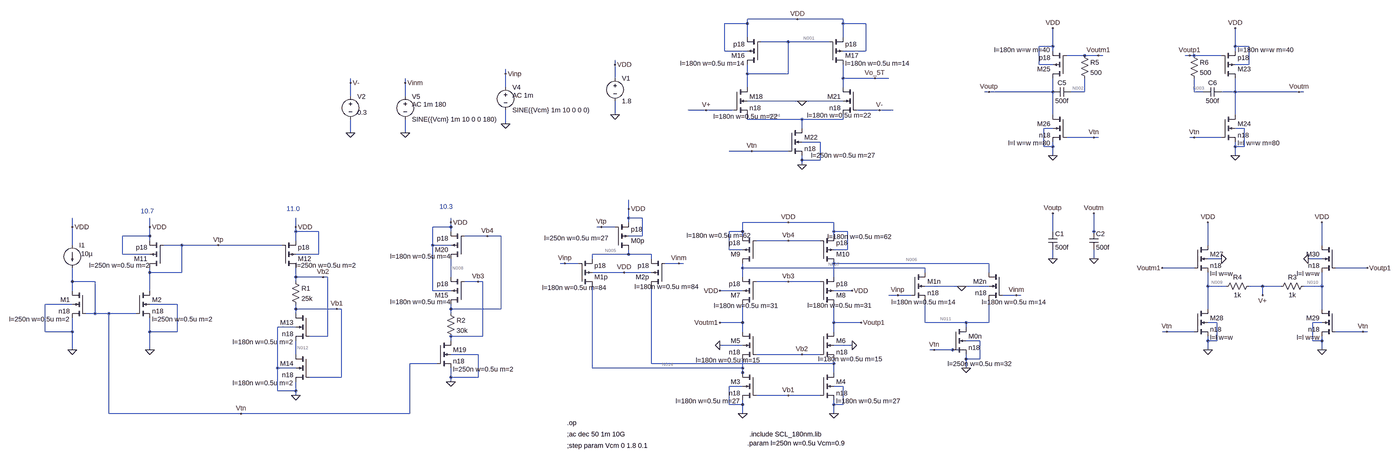
[diagram p0: schematic final_complete_design.asc, whole sheet]
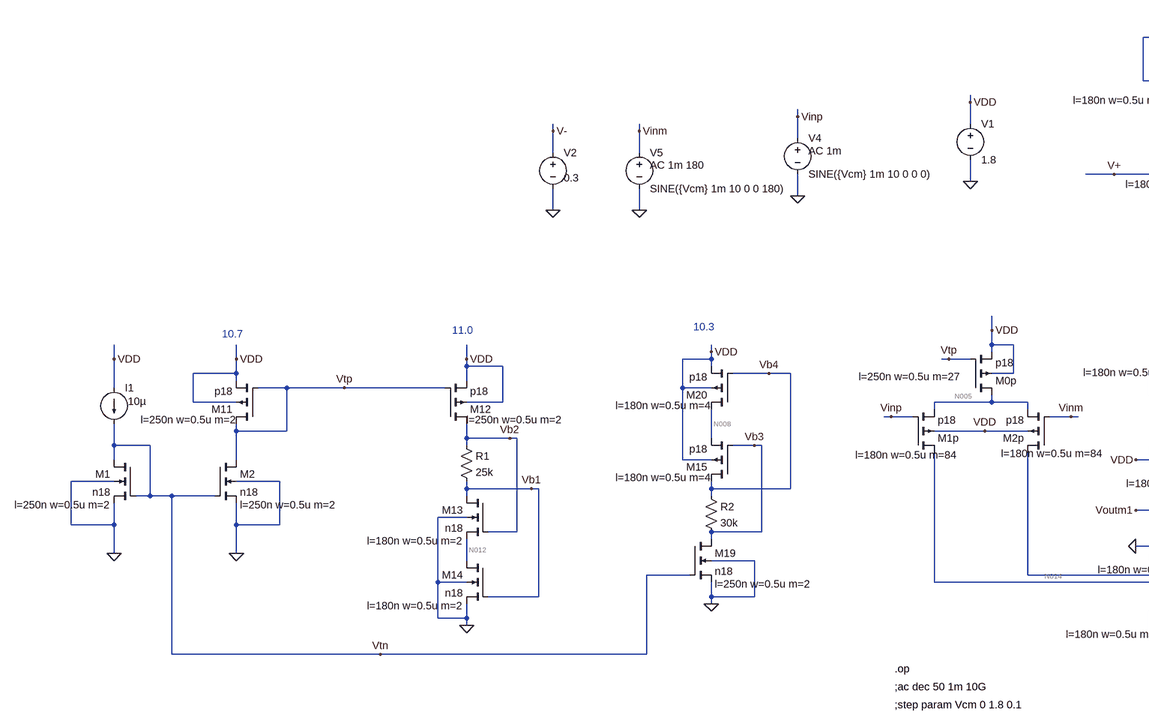
[diagram p1: schematic final_complete_design.asc, part, row 1 of 1, column 1 of 2]
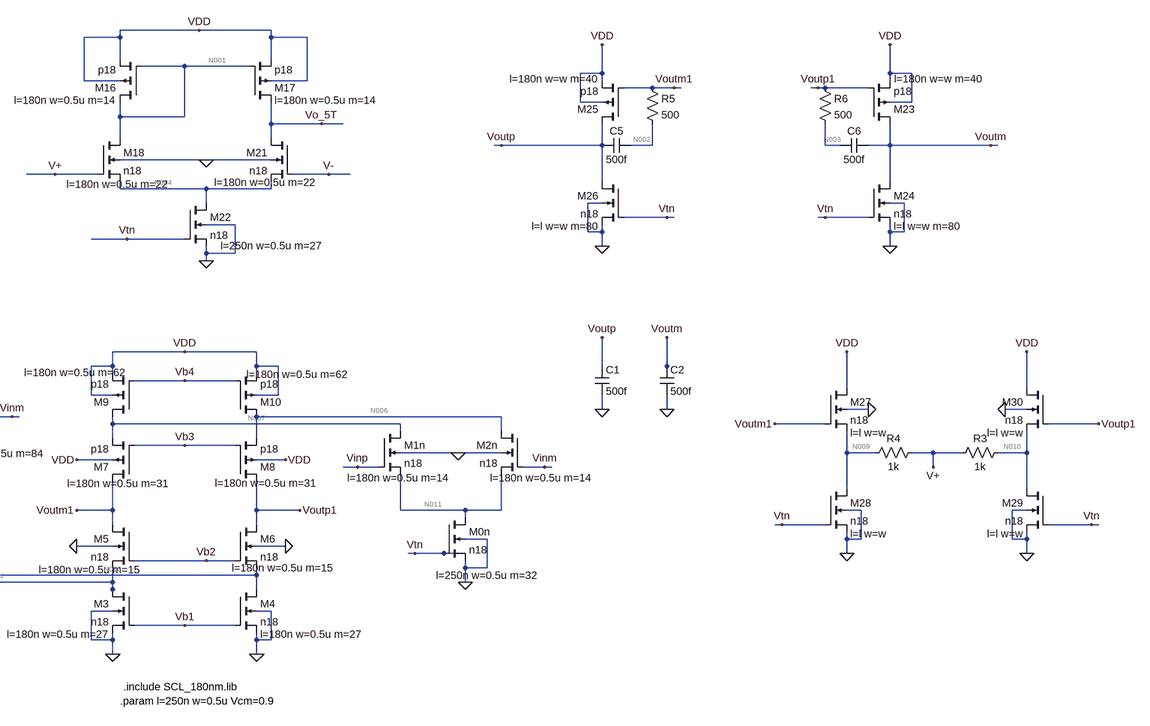
[diagram p2: schematic final_complete_design.asc, part, row 1 of 1, column 2 of 2]
final_complete_design.asc, the LTspice schematic file:
Version 4
SHEET 1 2868 680
WIRE 544 -1072 368 -1072
WIRE 704 -1072 544 -1072
WIRE 368 -1056 368 -1072
WIRE 368 -1056 288 -1056
WIRE 704 -1056 704 -1072
WIRE 784 -1056 704 -1056
WIRE 368 -1008 368 -1056
WIRE 704 -1008 704 -1056
WIRE 512 -992 416 -992
WIRE 656 -992 512 -992
WIRE 1440 -976 1440 -1040
WIRE 1440 -976 1392 -976
WIRE 2080 -976 2080 -1040
WIRE 2128 -976 2080 -976
WIRE 288 -960 288 -1056
WIRE 368 -960 288 -960
WIRE 784 -960 784 -1056
WIRE 784 -960 704 -960
WIRE 1440 -960 1440 -976
WIRE 2080 -960 2080 -976
WIRE 1552 -944 1488 -944
WIRE 1600 -944 1552 -944
WIRE 1616 -944 1600 -944
WIRE 1920 -944 1904 -944
WIRE 1936 -944 1920 -944
WIRE 2032 -944 1936 -944
WIRE -96 -912 -96 -928
WIRE 1392 -912 1392 -976
WIRE 1440 -912 1392 -912
WIRE 2128 -912 2128 -976
WIRE 2128 -912 2080 -912
WIRE -480 -880 -480 -896
WIRE 368 -880 368 -912
WIRE 512 -880 512 -992
WIRE 512 -880 368 -880
WIRE -96 -864 -96 -912
WIRE 704 -864 704 -912
WIRE 816 -864 704 -864
WIRE 864 -864 816 -864
WIRE -1024 -848 -1024 -864
WIRE -832 -848 -832 -864
WIRE -480 -832 -480 -880
WIRE 368 -832 368 -880
WIRE 704 -832 704 -864
WIRE 1216 -816 1200 -816
WIRE 1440 -816 1440 -864
WIRE 1440 -816 1216 -816
WIRE 1552 -816 1552 -864
WIRE 1552 -816 1504 -816
WIRE 1936 -816 1936 -864
WIRE 1968 -816 1936 -816
WIRE 2080 -816 2080 -864
WIRE 2080 -816 2032 -816
WIRE 2304 -816 2080 -816
WIRE 2320 -816 2304 -816
WIRE -1024 -800 -1024 -848
WIRE -832 -800 -832 -848
WIRE 560 -784 368 -784
WIRE 704 -784 560 -784
WIRE 224 -752 160 -752
WIRE 320 -752 224 -752
WIRE 832 -752 752 -752
WIRE 880 -752 832 -752
WIRE -96 -736 -96 -784
WIRE 1440 -736 1440 -816
WIRE 2080 -736 2080 -816
WIRE 368 -720 368 -736
WIRE 560 -720 368 -720
WIRE 704 -720 704 -736
WIRE 704 -720 560 -720
WIRE -480 -704 -480 -752
WIRE 560 -688 560 -720
WIRE 1440 -688 1408 -688
WIRE 2112 -688 2080 -688
WIRE -1024 -672 -1024 -720
WIRE -832 -672 -832 -720
WIRE 1584 -656 1488 -656
WIRE 1600 -656 1584 -656
WIRE 1936 -656 1920 -656
WIRE 2032 -656 1936 -656
WIRE 624 -640 560 -640
WIRE 1408 -624 1408 -688
WIRE 1440 -624 1440 -640
WIRE 1440 -624 1408 -624
WIRE 2080 -624 2080 -640
WIRE 2112 -624 2112 -688
WIRE 2112 -624 2080 -624
WIRE 384 -608 304 -608
WIRE 512 -608 384 -608
WIRE 1440 -592 1440 -624
WIRE 2080 -592 2080 -624
WIRE 560 -576 560 -592
WIRE 624 -576 624 -640
WIRE 624 -576 560 -576
WIRE 560 -560 560 -576
WIRE -48 -352 -48 -384
WIRE -48 -320 -48 -352
WIRE 0 -320 -48 -320
WIRE -672 -304 -672 -320
WIRE -48 -304 -48 -320
WIRE 512 -304 352 -304
WIRE 672 -304 512 -304
WIRE -2000 -288 -2000 -320
WIRE -1728 -288 -1728 -320
WIRE -1216 -288 -1216 -320
WIRE -672 -288 -672 -304
WIRE -672 -288 -736 -288
WIRE -144 -288 -160 -288
WIRE -96 -288 -144 -288
WIRE -1216 -272 -1216 -288
WIRE -1136 -272 -1216 -272
WIRE -672 -272 -672 -288
WIRE 352 -272 352 -304
WIRE 352 -272 304 -272
WIRE 672 -272 672 -304
WIRE 720 -272 672 -272
WIRE 1440 -272 1440 -336
WIRE 1584 -272 1584 -336
WIRE -1728 -256 -1728 -288
WIRE -1728 -256 -1824 -256
WIRE -544 -256 -624 -256
WIRE -496 -256 -544 -256
WIRE 0 -256 0 -320
WIRE 0 -256 -48 -256
WIRE 352 -256 352 -272
WIRE 672 -256 672 -272
WIRE 1584 -256 1584 -272
WIRE -1728 -240 -1728 -256
WIRE -1216 -240 -1216 -272
WIRE 512 -240 400 -240
WIRE 624 -240 512 -240
WIRE -2000 -224 -2000 -288
WIRE -1616 -224 -1680 -224
WIRE -1488 -224 -1616 -224
WIRE -1264 -224 -1488 -224
WIRE -736 -224 -736 -288
WIRE -672 -224 -736 -224
WIRE 1984 -224 1984 -304
WIRE 2384 -224 2384 -304
WIRE 304 -208 304 -272
WIRE 352 -208 304 -208
WIRE 720 -208 720 -272
WIRE 720 -208 672 -208
WIRE -1824 -192 -1824 -256
WIRE -1728 -192 -1824 -192
WIRE -1136 -192 -1136 -272
WIRE -1136 -192 -1216 -192
WIRE -48 -192 -48 -208
WIRE -48 -192 -176 -192
WIRE 32 -192 -48 -192
WIRE -176 -176 -176 -192
WIRE 32 -176 32 -192
WIRE 1440 -176 1440 -208
WIRE 1584 -176 1584 -208
WIRE 2032 -176 1984 -176
WIRE 2384 -176 2336 -176
WIRE -272 -160 -288 -160
WIRE -224 -160 -272 -160
WIRE 128 -160 80 -160
WIRE 144 -160 128 -160
WIRE 1216 -160 672 -160
WIRE 352 -144 352 -160
WIRE 992 -144 352 -144
WIRE 1936 -144 1824 -144
WIRE 2544 -144 2432 -144
WIRE -1728 -128 -1728 -144
WIRE -1616 -128 -1616 -224
WIRE -1616 -128 -1728 -128
WIRE -64 -128 -176 -128
WIRE 32 -128 -64 -128
WIRE 992 -128 992 -144
WIRE 1216 -128 1216 -160
WIRE -1216 -112 -1216 -144
WIRE -1120 -112 -1216 -112
WIRE -1104 -112 -1120 -112
WIRE -672 -112 -672 -176
WIRE 352 -112 352 -144
WIRE 672 -112 672 -160
WIRE -2000 -96 -2000 -144
WIRE -1920 -96 -2000 -96
WIRE -1216 -96 -1216 -112
WIRE -576 -96 -624 -96
WIRE -560 -96 -576 -96
WIRE 512 -96 400 -96
WIRE 624 -96 512 -96
WIRE 1120 -80 992 -80
WIRE 1216 -80 1120 -80
WIRE 1984 -80 1984 -128
WIRE 2048 -80 1984 -80
WIRE 2176 -80 2128 -80
WIRE 2240 -80 2176 -80
WIRE 2384 -80 2384 -128
WIRE 2384 -80 2320 -80
WIRE -2000 -64 -2000 -96
WIRE -1728 -64 -1728 -128
WIRE -736 -64 -736 -224
WIRE -672 -64 -736 -64
WIRE 352 -64 272 -64
WIRE 736 -64 672 -64
WIRE 896 -48 864 -48
WIRE 944 -48 896 -48
WIRE 1312 -48 1264 -48
WIRE 1328 -48 1312 -48
WIRE 2176 -48 2176 -80
WIRE -2000 -16 -2096 -16
WIRE -1632 -16 -1728 -16
WIRE -1216 0 -1216 -16
WIRE -1072 0 -1216 0
WIRE -1056 0 -1072 0
WIRE -672 0 -672 -16
WIRE -496 0 -496 -256
WIRE -496 0 -672 0
WIRE 1984 0 1984 -80
WIRE 2384 0 2384 -80
WIRE -1920 16 -1920 -96
WIRE -1920 16 -1952 16
WIRE -1872 16 -1920 16
WIRE -1776 16 -1872 16
WIRE -1216 16 -1216 0
WIRE -672 16 -672 0
WIRE 352 48 352 -16
WIRE 352 48 272 48
WIRE 672 48 672 -16
WIRE 768 48 672 48
WIRE 992 48 992 -32
WIRE 1136 48 992 48
WIRE 1216 48 1216 -32
WIRE 1216 48 1136 48
WIRE 2016 48 1984 48
WIRE 2384 48 2352 48
WIRE -1216 64 -1280 64
WIRE 1136 64 1136 48
WIRE -2096 80 -2096 -16
WIRE -2000 80 -2000 32
WIRE -2000 80 -2096 80
WIRE -1728 80 -1728 32
WIRE -1632 80 -1632 -16
WIRE -1632 80 -1728 80
WIRE 352 80 352 48
WIRE 672 80 672 48
WIRE 1840 80 1824 80
WIRE 1936 80 1840 80
WIRE 2528 80 2432 80
WIRE 2544 80 2528 80
WIRE -1104 96 -1104 -112
WIRE -1104 96 -1168 96
WIRE -560 96 -560 -96
WIRE -560 96 -672 96
WIRE -672 112 -672 96
WIRE 1184 112 1136 112
WIRE 1984 112 1984 96
WIRE 2016 112 2016 48
WIRE 2016 112 1984 112
WIRE 2352 112 2352 48
WIRE 2384 112 2384 96
WIRE 2384 112 2352 112
WIRE 352 128 272 128
WIRE 736 128 672 128
WIRE -2000 144 -2000 80
WIRE -1728 144 -1728 80
WIRE 1024 144 1008 144
WIRE 1088 144 1024 144
WIRE 1120 144 1088 144
WIRE 1984 144 1984 112
WIRE 2384 144 2384 112
WIRE -1216 160 -1216 112
WIRE -576 160 -672 160
WIRE 560 160 400 160
WIRE 624 160 560 160
WIRE 1136 176 1136 160
WIRE 1184 176 1184 112
WIRE 1184 176 1136 176
WIRE -720 192 -816 192
WIRE 32 192 32 -80
WIRE 672 192 672 176
WIRE 672 192 32 192
WIRE -1280 208 -1280 64
WIRE -1216 208 -1280 208
WIRE -176 208 -176 -80
WIRE 352 208 352 176
WIRE 352 208 -176 208
WIRE 1136 208 1136 176
WIRE 352 224 352 208
WIRE 672 224 672 192
WIRE -1056 240 -1056 0
WIRE -1056 240 -1168 240
WIRE -672 240 -672 208
WIRE -576 240 -576 160
WIRE -576 240 -672 240
WIRE 352 240 352 224
WIRE -672 256 -672 240
WIRE 352 272 304 272
WIRE 704 272 672 272
WIRE -1280 288 -1280 208
WIRE -1216 288 -1216 256
WIRE -1216 288 -1280 288
WIRE -1216 304 -1216 288
WIRE 512 304 400 304
WIRE 624 304 512 304
WIRE 304 336 304 272
WIRE 352 336 352 320
WIRE 352 336 304 336
WIRE 672 336 672 320
WIRE 704 336 704 272
WIRE 704 336 672 336
WIRE -1872 368 -1872 16
WIRE -1408 368 -1872 368
WIRE -816 368 -816 192
WIRE -816 368 -1408 368
WIRE 352 368 352 336
WIRE 672 368 672 336
FLAG -48 -352 VDD
FLAG 352 368 0
FLAG 672 368 0
FLAG 1136 208 0
FLAG 512 -304 VDD
FLAG 272 -64 VDD
FLAG 736 -64 VDD
FLAG -64 -128 VDD
FLAG 736 128 0
FLAG 272 128 0
FLAG 1120 -80 0
FLAG -96 -736 0
FLAG -96 -912 VDD
FLAG 512 -96 Vb3
FLAG 512 -240 Vb4
FLAG -144 -288 Vtp
FLAG 1024 144 Vtn
FLAG 1312 -48 Vinm
FLAG 128 -160 Vinm
FLAG -272 -160 Vinp
FLAG 896 -48 Vinp
FLAG 272 48 Voutm1
FLAG 768 48 Voutp1
FLAG -480 -704 0
FLAG -480 -880 Vinp
FLAG -832 -672 0
FLAG -832 -848 Vinm
FLAG 1440 -176 0
FLAG 1584 -176 0
FLAG 1584 -336 Voutm
FLAG 1440 -336 Voutp
FLAG -2000 144 0
FLAG -2000 -288 VDD
FLAG -1728 144 0
FLAG -1728 -288 VDD
FLAG -1216 -288 VDD
FLAG -1216 304 0
FLAG -672 256 0
FLAG -672 -304 VDD
FLAG -544 -256 Vb4
FLAG -576 -96 Vb3
FLAG -1120 -112 Vb2
FLAG -1072 0 Vb1
FLAG -1488 -224 Vtp
FLAG -1408 368 Vtn
FLAG 560 160 Vb2
FLAG 560 -560 0
FLAG 816 -864 Vo_5T
FLAG 544 -1072 VDD
FLAG 224 -752 V+
FLAG 832 -752 V-
FLAG 560 -784 0
FLAG 384 -608 Vtn
FLAG -1024 -672 0
FLAG -1024 -848 V-
FLAG 2176 -48 V+
FLAG 512 304 Vb1
FLAG 2080 -592 0
FLAG 2080 -1040 VDD
FLAG 1920 -944 Voutp1
FLAG 1936 -656 Vtn
FLAG 2304 -816 Voutm
FLAG 1440 -592 0
FLAG 1440 -1040 VDD
FLAG 1600 -944 Voutm1
FLAG 1584 -656 Vtn
FLAG 1216 -816 Voutp
FLAG 1984 144 0
FLAG 1984 -304 VDD
FLAG 1840 80 Vtn
FLAG 2032 -176 0
FLAG 1824 -144 Voutm1
FLAG 2384 144 0
FLAG 2384 -304 VDD
FLAG 2528 80 Vtn
FLAG 2336 -176 0
FLAG 2544 -144 Voutp1
DATAFLAG 864 -864 ""
DATAFLAG 1536 -656 ""
DATAFLAG -1824 16 ""
DATAFLAG 1888 80 ""
SYMBOL pmos4 -96 -208 M180
WINDOW 123 -248 41 Left 2
SYMATTR Value2 l=250n w=0.5u m=27
SYMATTR InstName M0p
SYMATTR Value p18
SYMBOL pmos4 624 -16 M180
WINDOW 123 -45 -4 Left 2
SYMATTR Value2 l=180n w=0.5u m=31
SYMATTR InstName M8
SYMATTR Value p18
SYMBOL pmos4 400 -16 R180
WINDOW 123 -78 -5 Left 2
SYMATTR Value2 l=180n w=0.5u m=31
SYMATTR InstName M7
SYMATTR Value p18
SYMBOL pmos4 624 -160 M180
WINDOW 123 25 94 Left 2
SYMATTR Value2 l=180n w=0.5u m=62
SYMATTR InstName M10
SYMATTR Value p18
SYMBOL pmos4 400 -160 R180
WINDOW 123 18 98 Left 2
SYMATTR Value2 l=180n w=0.5u m=62
SYMATTR InstName M9
SYMATTR Value p18
SYMBOL nmos4 624 80 R0
WINDOW 123 -7 96 Left 2
SYMATTR Value2 l=180n w=0.5u m=15
SYMATTR InstName M6
SYMATTR Value n18
SYMBOL nmos4 624 224 R0
WINDOW 123 56 100 Left 2
SYMATTR Value2 l=180n w=0.5u m=27
SYMATTR InstName M4
SYMATTR Value n18
SYMBOL nmos4 400 80 M0
WINDOW 123 -15 100 Left 2
SYMATTR Value2 l=180n w=0.5u m=15
SYMATTR InstName M5
SYMATTR Value n18
SYMBOL nmos4 400 224 M0
WINDOW 123 56 100 Left 2
SYMATTR Value2 l=180n w=0.5u m=27
SYMATTR InstName M3
SYMATTR Value n18
SYMBOL pmos4 80 -80 R180
WINDOW 123 -120 -2 Left 2
SYMATTR Value2 l=180n w=0.5u m=84
SYMATTR InstName M2p
SYMATTR Value p18
SYMBOL pmos4 -224 -80 M180
WINDOW 123 -128 -5 Left 2
SYMATTR Value2 l=180n w=0.5u m=84
SYMATTR InstName M1p
SYMATTR Value p18
SYMBOL nmos4 1264 -128 M0
WINDOW 123 -154 104 Left 2
SYMATTR Value2 l=180n w=0.5u m=14
SYMATTR InstName M2n
SYMATTR Value n18
SYMBOL nmos4 944 -128 R0
WINDOW 123 -71 104 Left 2
SYMATTR Value2 l=180n w=0.5u m=14
SYMATTR InstName M1n
SYMATTR Value n18
SYMBOL nmos4 1088 64 R0
WINDOW 123 -17 129 Left 2
SYMATTR Value2 l=250n w=0.5u m=32
SYMATTR InstName M0n
SYMATTR Value n18
SYMBOL voltage -96 -880 R0
WINDOW 123 0 0 Left 0
WINDOW 39 0 0 Left 0
SYMATTR InstName V1
SYMATTR Value 1.8
SYMBOL voltage -480 -848 R0
WINDOW 123 24 44 Left 2
WINDOW 39 0 0 Left 0
SYMATTR Value2 AC 1m
SYMATTR InstName V4
SYMATTR Value SINE({Vcm} 1m 10 0 0 0)
SYMBOL voltage -832 -816 R0
WINDOW 123 24 44 Left 2
WINDOW 39 0 0 Left 0
SYMATTR Value2 AC 1m 180
SYMATTR InstName V5
SYMATTR Value SINE({Vcm} 1m 10 0 0 180)
SYMBOL cap 1424 -272 R0
SYMATTR InstName C1
SYMATTR Value 500f
SYMBOL cap 1568 -272 R0
SYMATTR InstName C2
SYMATTR Value 500f
SYMBOL current -2000 -224 R0
WINDOW 123 0 0 Left 0
WINDOW 39 0 0 Left 0
WINDOW 3 31 30 Left 2
SYMATTR Value 10µ
SYMATTR InstName I1
SYMBOL nmos4 -1952 -64 M0
WINDOW 123 56 100 Left 2
SYMATTR Value2 l=250n w=0.5u m=2
SYMATTR InstName M1
SYMATTR Value n18
SYMBOL nmos4 -1776 -64 R0
WINDOW 123 56 100 Left 2
SYMATTR Value2 l=250n w=0.5u m=2
SYMATTR InstName M2
SYMATTR Value n18
SYMBOL pmos4 -1680 -144 R180
WINDOW 123 47 9 Left 2
SYMATTR Value2 l=250n w=0.5u m=2
SYMATTR InstName M11
SYMATTR Value p18
SYMBOL pmos4 -1264 -144 M180
WINDOW 123 47 9 Left 2
SYMATTR Value2 l=250n w=0.5u m=2
SYMATTR InstName M12
SYMATTR Value p18
SYMBOL res -1232 -112 R0
SYMATTR InstName R1
SYMATTR Value 25k
SYMBOL res -688 0 R0
SYMATTR InstName R2
SYMATTR Value 30k
SYMBOL nmos4 -1168 16 M0
WINDOW 123 56 100 Left 2
SYMATTR Value2 l=180n w=0.5u m=2
SYMATTR InstName M13
SYMATTR Value n18
SYMBOL nmos4 -1168 160 M0
WINDOW 123 56 100 Left 2
SYMATTR Value2 l=180n w=0.5u m=2
SYMATTR InstName M14
SYMATTR Value n18
SYMBOL pmos4 -624 -16 R180
WINDOW 123 47 9 Left 2
SYMATTR Value2 l=180n w=0.5u m=4
SYMATTR InstName M15
SYMATTR Value p18
SYMBOL nmos4 -720 112 R0
WINDOW 123 56 100 Left 2
SYMATTR Value2 l=250n w=0.5u m=2
SYMATTR InstName M19
SYMATTR Value n18
SYMBOL pmos4 -624 -176 R180
WINDOW 123 47 9 Left 2
SYMATTR Value2 l=180n w=0.5u m=4
SYMATTR InstName M20
SYMATTR Value p18
SYMBOL res 2336 -96 R90
WINDOW 0 0 56 VBottom 2
WINDOW 3 32 56 VTop 2
SYMATTR InstName R3
SYMATTR Value 1k
SYMBOL res 2144 -96 R90
WINDOW 0 0 56 VBottom 2
WINDOW 3 32 56 VTop 2
SYMATTR InstName R4
SYMATTR Value 1k
SYMBOL pmos4 416 -912 R180
WINDOW 123 56 4 Left 2
SYMATTR Value2 l=180n w=0.5u m=14
SYMATTR InstName M16
SYMATTR Value p18
SYMBOL pmos4 656 -912 M180
WINDOW 123 56 4 Left 2
SYMATTR Value2 l=180n w=0.5u m=14
SYMATTR InstName M17
SYMATTR Value p18
SYMBOL nmos4 320 -832 R0
WINDOW 123 -71 102 Left 2
SYMATTR Value2 l=180n w=0.5u m=22
SYMATTR InstName M18
SYMATTR Value n18
SYMBOL nmos4 752 -832 M0
WINDOW 123 -53 98 Left 2
SYMATTR Value2 l=180n w=0.5u m=22
SYMATTR InstName M21
SYMATTR Value n18
SYMBOL nmos4 512 -688 R0
WINDOW 123 80 95 Left 2
SYMATTR Value2 l=250n w=0.5u m=27
SYMATTR InstName M22
SYMATTR Value n18
SYMBOL voltage -1024 -816 R0
WINDOW 123 24 44 Left 2
WINDOW 39 0 0 Left 0
WINDOW 3 24 72 Left 2
SYMATTR Value 0.3
SYMATTR InstName V2
SYMBOL pmos4 2032 -864 M180
WINDOW 123 57 100 Left 2
SYMATTR Value2 l=180n w=w m=40
SYMATTR InstName M23
SYMATTR Value p18
SYMBOL nmos4 2032 -736 R0
WINDOW 123 56 100 Left 2
SYMATTR Value2 l=l w=w m=80
SYMATTR InstName M24
SYMATTR Value n18
SYMBOL pmos4 1488 -864 R180
WINDOW 123 57 100 Left 2
SYMATTR Value2 l=180n w=w m=40
SYMATTR InstName M25
SYMATTR Value p18
SYMBOL nmos4 1488 -736 M0
WINDOW 123 56 100 Left 2
SYMATTR Value2 l=l w=w m=80
SYMATTR InstName M26
SYMATTR Value n18
SYMBOL nmos4 1936 0 R0
WINDOW 123 56 100 Left 2
SYMATTR Value2 l=l w=w
SYMATTR InstName M28
SYMATTR Value n18
SYMBOL nmos4 1936 -224 R0
WINDOW 123 56 100 Left 2
SYMATTR Value2 l=l w=w
SYMATTR InstName M27
SYMATTR Value n18
SYMBOL nmos4 2432 0 M0
WINDOW 123 56 100 Left 2
SYMATTR Value2 l=l w=w
SYMATTR InstName M29
SYMATTR Value n18
SYMBOL nmos4 2432 -224 M0
WINDOW 123 56 100 Left 2
SYMATTR Value2 l=l w=w
SYMATTR InstName M30
SYMATTR Value n18
SYMBOL res 1536 -960 R0
SYMATTR InstName R5
SYMATTR Value 500
SYMBOL cap 1504 -832 R90
WINDOW 0 0 32 VBottom 2
WINDOW 3 32 32 VTop 2
SYMATTR InstName C5
SYMATTR Value 500f
SYMBOL res 1920 -960 R0
SYMATTR InstName R6
SYMATTR Value 500
SYMBOL cap 2032 -832 R90
WINDOW 0 0 32 VBottom 2
WINDOW 3 32 32 VTop 2
SYMATTR InstName C6
SYMATTR Value 500f
TEXT 376 440 Left 2 !.include SCL_180nm.lib
TEXT -264 400 Left 2 !.op
TEXT -1760 -344 Left 2 ;10.7
TEXT -1248 -352 Left 2 ;11.0
TEXT -712 -360 Left 2 ;10.3
TEXT -264 440 Left 2 !;ac dec 50 1m 10G
TEXT -264 480 Left 2 !;step param Vcm 0 1.8 0.1
TEXT 368 472 Left 2 !.param l=250n w=0.5u Vcm=0.9

The netlist it stands for:
* final_complete_design.asc
M0p N005 Vtp VDD VDD p18 l=250n w=0.5u m=27
M8 Voutp1 Vb3 N006 VDD p18 l=180n w=0.5u m=31
M7 Voutm1 Vb3 N007 VDD p18 l=180n w=0.5u m=31
M10 N006 Vb4 VDD VDD p18 l=180n w=0.5u m=62
M9 N007 Vb4 VDD VDD p18 l=180n w=0.5u m=62
M6 Voutp1 Vb2 N013 0 n18 l=180n w=0.5u m=15
M4 N013 Vb1 0 0 n18 l=180n w=0.5u m=27
M5 Voutm1 Vb2 N014 0 n18 l=180n w=0.5u m=15
M3 N014 Vb1 0 0 n18 l=180n w=0.5u m=27
M2p N013 Vinm N005 VDD p18 l=180n w=0.5u m=84
M1p N014 Vinp N005 VDD p18 l=180n w=0.5u m=84
M2n N006 Vinm N011 0 n18 l=180n w=0.5u m=14
M1n N007 Vinp N011 0 n18 l=180n w=0.5u m=14
M0n N011 Vtn 0 0 n18 l=250n w=0.5u m=32
V1 VDD 0 1.8
V4 Vinp 0 SINE({Vcm} 1m 10 0 0 0) AC 1m
V5 Vinm 0 SINE({Vcm} 1m 10 0 0 180) AC 1m 180
C1 Voutp 0 500f
C2 Voutm 0 500f
I1 VDD Vtn 10µ
M1 Vtn Vtn 0 0 n18 l=250n w=0.5u m=2
M2 Vtp Vtn 0 0 n18 l=250n w=0.5u m=2
M11 Vtp Vtp VDD VDD p18 l=250n w=0.5u m=2
M12 Vb2 Vtp VDD VDD p18 l=250n w=0.5u m=2
R1 Vb2 Vb1 25k
R2 Vb4 Vb3 30k
M13 Vb1 Vb2 N012 0 n18 l=180n w=0.5u m=2
M14 N012 Vb1 0 0 n18 l=180n w=0.5u m=2
M15 Vb4 Vb3 N008 VDD p18 l=180n w=0.5u m=4
M19 Vb3 Vtn 0 0 n18 l=250n w=0.5u m=2
M20 N008 Vb4 VDD VDD p18 l=180n w=0.5u m=4
R3 N010 V+ 1k
R4 V+ N009 1k
M16 N001 N001 VDD VDD p18 l=180n w=0.5u m=14
M17 Vo_5T N001 VDD VDD p18 l=180n w=0.5u m=14
M18 N001 V+ N004 0 n18 l=180n w=0.5u m=22
M21 Vo_5T V- N004 0 n18 l=180n w=0.5u m=22
M22 N004 Vtn 0 0 n18 l=250n w=0.5u m=27
V2 V- 0 0.3
M23 Voutm Voutp1 VDD VDD p18 l=180n w=w m=40
M24 Voutm Vtn 0 0 n18 l=l w=w m=80
M25 Voutp Voutm1 VDD VDD p18 l=180n w=w m=40
M26 Voutp Vtn 0 0 n18 l=l w=w m=80
M28 N009 Vtn 0 0 n18 l=l w=w
M27 VDD Voutm1 N009 0 n18 l=l w=w
M29 N010 Vtn 0 0 n18 l=l w=w
M30 VDD Voutp1 N010 0 n18 l=l w=w
R5 Voutm1 N002 500
C5 N002 Voutp 500f
R6 Voutp1 N003 500
C6 Voutm N003 500f
.model NMOS NMOS
.model PMOS PMOS
.lib standard.mos
.include SCL_180nm.lib
.op
* 10.7
* 11.0
* 10.3
;ac dec 50 1m 10G
;step param Vcm 0 1.8 0.1
.param l=250n w=0.5u Vcm=0.9
.backanno
.end

* Results of the author's LTspice run, read from the files saved beside the schematic
* Operating Point:
*   V(n005) = 1.546 V
*   V(vtp) = 1.083 V
*   V(vdd) = 1.8 V
*   V(voutp1) = 663.6 mV
*   V(vb3) = 790.3 mV
*   V(n006) = 1.549 V
*   V(voutm1) = 663.6 mV
*   V(n007) = 1.549 V
*   V(vb4) = 1.1 V
*   V(vb2) = 876.9 mV
*   V(n013) = 239.5 mV
*   V(vb1) = 600.7 mV
*   V(n014) = 239.5 mV
*   V(vinm) = 900 mV
*   V(vinp) = 900 mV
*   V(n011) = 283.2 mV
*   V(vtn) = 593.1 mV
*   V(voutp) = 1.661 V
*   V(voutm) = 1.661 V
*   V(n012) = 240.2 mV
*   V(n008) = 1.551 V
*   V(n010) = 92.98 mV
*   V(v+) = 92.98 mV
*   V(n009) = 92.98 mV
*   V(n001) = 1.632 V
*   V(vo_5t) = 184.1 µV
*   V(n004) = 1.356 µV
*   V(v-) = 300 mV
*   V(n002) = 663.6 mV
*   V(n003) = 663.6 mV
*   Id(M30) = 3.483 µA
*   Ig(M30) = 0 A
*   Ib(M30) = -1.912 pA
*   Is(M30) = -3.483 µA
*   Id(M29) = 3.483 µA
*   Ig(M29) = 0 A
*   Ib(M29) = -102.2 fA
*   Is(M29) = -3.483 µA
*   Id(M27) = 3.483 µA
*   Ig(M27) = 0 A
*   Ib(M27) = -1.912 pA
*   Is(M27) = -3.483 µA
*   Id(M28) = 3.483 µA
*   Ig(M28) = 0 A
*   Ib(M28) = -102.2 fA
*   Is(M28) = -3.483 µA
*   Id(M26) = 450.2 µA
*   Ig(M26) = 0 A
*   Ib(M26) = -133.7 pA
*   Is(M26) = -450.2 µA
*   Id(M24) = 450.2 µA
*   Ig(M24) = 0 A
*   Ib(M24) = -133.7 pA
*   Is(M24) = -450.2 µA
*   Id(M22) = 2.054 nA
*   Ig(M22) = 0 A
*   Ib(M22) = 0 A
*   Is(M22) = -2.054 nA
*   Id(M21) = 1.399 nA
*   Ig(M21) = 0 A
*   Ib(M21) = -5.183 fA
*   Is(M21) = -1.399 nA
*   Id(M18) = 691.5 pA
*   Ig(M18) = 0 A
*   Ib(M18) = -36.12 pA
*   Is(M18) = -655.4 pA
*   Id(M19) = 10.31 µA
*   Ig(M19) = 0 A
*   Ib(M19) = -1.601 pA
*   Is(M19) = -10.31 µA
*   Id(M14) = 11.05 µA
*   Ig(M14) = 0 A
*   Ib(M14) = -500.4 fA
*   Is(M14) = -11.05 µA
*   Id(M13) = 11.05 µA
*   Ig(M13) = 0 A
*   Ib(M13) = -1.722 pA
*   Is(M13) = -11.05 µA
*   Id(M2) = 10.68 µA
*   Ig(M2) = 0 A
*   Ib(M2) = -2.186 pA
*   Is(M2) = -10.68 µA
*   Id(M1) = 10 µA
*   Ig(M1) = 0 A
*   Ib(M1) = -1.206 pA
*   Is(M1) = -10 µA
*   Id(M0n) = 147.8 µA
*   Ig(M0n) = 0 A
*   Ib(M0n) = -9.383 pA
*   Is(M0n) = -147.8 µA
*   Id(M1n) = 73.89 µA
*   Ig(M1n) = 0 A
*   Ib(M1n) = -25.93 pA
*   Is(M1n) = -73.89 µA
*   Id(M2n) = 73.89 µA
*   Ig(M2n) = 0 A
*   Ib(M2n) = -25.93 pA
*   Is(M2n) = -73.89 µA
*   Id(M3) = 149.1 µA
*   Ig(M3) = 0 A
*   Ib(M3) = -6.737 pA
*   Is(M3) = -149.1 µA
*   Id(M5) = 86.1 µA
*   Ig(M5) = 0 A
*   Ib(M5) = -13.85 pA
*   Is(M5) = -86.1 µA
*   Id(M4) = 149.1 µA
*   Ig(M4) = 0 A
*   Ib(M4) = -6.737 pA
*   Is(M4) = -149.1 µA
*   Id(M6) = 86.1 µA
*   Ig(M6) = 0 A
*   Ib(M6) = -13.85 pA
*   Is(M6) = -86.1 µA
*   Id(M25) = -450.2 µA
*   Ig(M25) = 0 A
*   Ib(M25) = 5.965 pA
*   Is(M25) = 450.2 µA
*   Id(M23) = -450.2 µA
*   Ig(M23) = 0 A
*   Ib(M23) = 5.965 pA
*   Is(M23) = 450.2 µA
*   Id(M17) = -1.399 nA
*   Ig(M17) = 0 A
*   Ib(M17) = 25.34 pA
*   Is(M17) = 1.373 nA
*   Id(M16) = -691.5 pA
*   Ig(M16) = 0 A
*   Ib(M16) = 2.492 pA
*   Is(M16) = 689 pA
*   Id(M20) = -10.31 µA
*   Ig(M20) = 0 A
*   Ib(M20) = 1.037 pA
*   Is(M20) = 10.31 µA
*   Id(M15) = -10.31 µA
*   Ig(M15) = 0 A
*   Ib(M15) = 3.878 pA
*   Is(M15) = 10.31 µA
*   Id(M12) = -11.05 µA
*   Ig(M12) = 0 A
*   Ib(M12) = 1.866 pA
*   Is(M12) = 11.05 µA
*   Id(M11) = -10.68 µA
*   Ig(M11) = 0 A
*   Ib(M11) = 1.454 pA
*   Is(M11) = 10.68 µA
*   Id(M1p) = -62.99 µA
*   Ig(M1p) = 0 A
*   Ib(M1p) = 154.1 pA
*   Is(M1p) = 62.99 µA
*   Id(M2p) = -62.99 µA
*   Ig(M2p) = 0 A
*   Ib(M2p) = 154.1 pA
*   Is(M2p) = 62.99 µA
*   Id(M9) = -160 µA
*   Ig(M9) = 0 A
*   Ib(M9) = 16.19 pA
*   Is(M9) = 160 µA
*   Id(M10) = -160 µA
*   Ig(M10) = 0 A
*   Ib(M10) = 16.19 pA
*   Is(M10) = 160 µA
*   Id(M7) = -86.1 µA
*   Ig(M7) = 0 A
*   Ib(M7) = 43.63 pA
*   Is(M7) = 86.1 µA
*   Id(M8) = -86.1 µA
*   Ig(M8) = 0 A
*   Ib(M8) = 43.63 pA
*   Is(M8) = 86.1 µA
*   Id(M0p) = -126 µA
*   Ig(M0p) = 0 A
*   Ib(M0p) = 7.116 pA
*   Is(M0p) = 126 µA
*   I(C6) = 0 A
*   I(C5) = 0 A
*   I(C2) = 0 A
*   I(C1) = 0 A
*   I(I1) = 10 µA
*   I(R6) = 0 A
*   I(R5) = 0 A
*   I(R4) = 0 A
*   I(R3) = 0 A
*   I(R2) = 10.31 µA
*   I(R1) = 11.05 µA
*   I(V2) = 0 A
*   I(V5) = 0 A
*   I(V4) = 0 A
*   I(V1) = -1.395 mA